# EAGLE design hw2 (EAGLE 7.5.0)
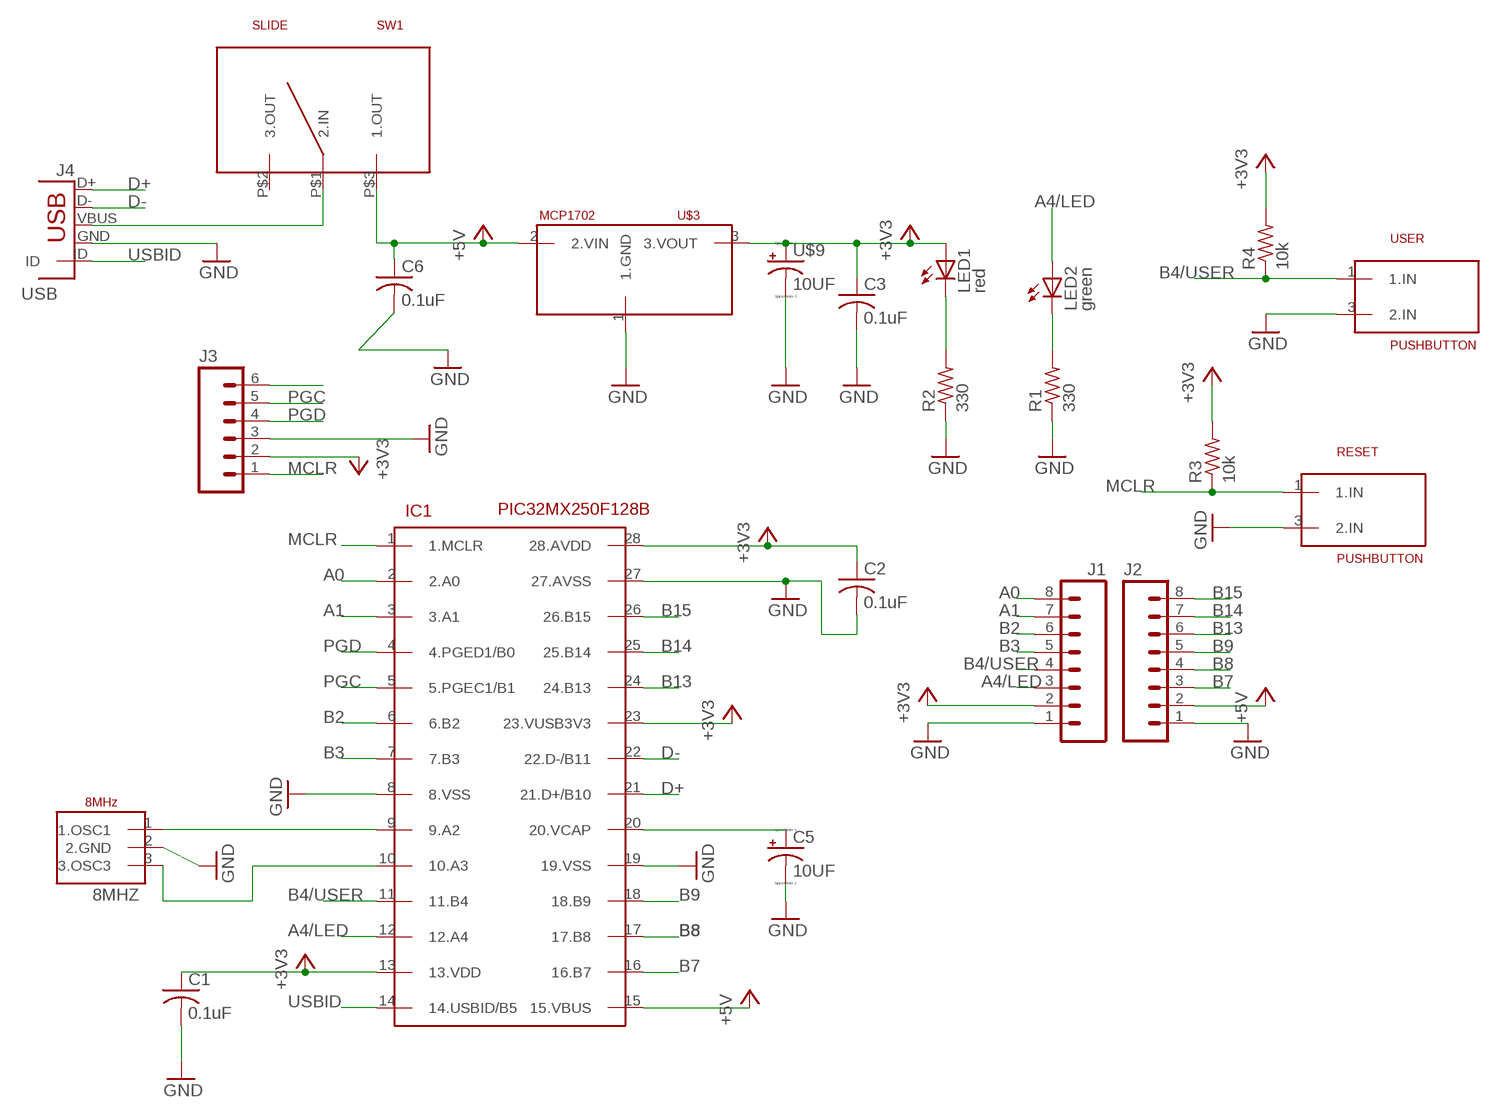
[diagram p0: schematic, sheet 1]

## Parts
C1  0.1uF  C-US025-025X050  [C025-025X050]
C2  0.1uF  C-US025-025X050  [C025-025X050]
C3  0.1uF  C-US025-025X050  [C025-025X050]
C5  10UF  [TT2D4]
C6  0.1uF  C-US025-025X050  [C025-025X050]
J1  M08  [1X08_ROUND]
J2  M08  [1X08_ROUND]
J3  M06SILK_FEMALE_PTH  [1X06]
J4  USB  [USB-MB-H]
LED1  red  LED3MM  [LED3MM]
LED2  green  LED3MM  [LED3MM]
PIC  PIC32MX250F128B  PIC  [DIL28-3]
R1  330  R-US_0207/10  [0207/10]
R2  330  R-US_0207/10  [0207/10]
R3  10k  R-US_0207/10  [0207/10]
R4  10k  R-US_0207/10  [0207/10]
RESET  PUSHBUTTON  [1X03]
SLIDE  SW1  SLIDE  [SLIDEWITCH]
U$2  8MHZ  [1X03]
U$3  MCP1702  [TO92]
U$9  10UF  [TT2D4]
USER  PUSHBUTTON  [1X03]

## Nets
+3V3: C1.1 C2.1 C3.1 J1.2 J3.2 LED1.A PIC.13(13.VDD) PIC.23(23.VUSB3V3) PIC.28(28.AVDD) R3.2 R4.2 U$3.3(3.VOUT) U$9.+
+5V: C6.1 J2.2 PIC.15(15.VBUS) SLIDE.P$3(1.OUT) U$3.2(2.VIN)
A0: J1.8 PIC.2(2.A0)
A1: J1.7 PIC.3(3.A1)
A4/LED: J1.3 LED2.A PIC.12(12.A4)
B2: J1.6 PIC.6(6.B2)
B3: J1.5 PIC.7(7.B3)
B4/USER: J1.4 PIC.11(11.B4) R4.1 USER.1(1.IN)
B7: J2.3 PIC.16(16.B7)
B8: J2.4 PIC.17(17.B8)
B9: J2.5 PIC.18(18.B9)
B13: J2.6 PIC.24(24.B13)
B14: J2.7 PIC.25(25.B14)
B15: J2.8 PIC.26(26.B15)
D+: J4.D+ PIC.21(21.D+/B10)
D-: J4.D- PIC.22(22.D-/B11)
GND: C1.2 C2.2 C3.2 C5.- C6.2 J1.1 J2.1 J3.3 J4.GND PIC.8(8.VSS) PIC.19(19.VSS) PIC.27(27.AVSS) R1.1 R2.1 RESET.3(2.IN) U$2.2(2.GND) U$3.1(1.GND) U$9.- USER.3(2.IN)
MCLR: J3.1 PIC.1(1.MCLR) R3.1 RESET.1(1.IN)
N$1: LED2.K(C) R1.2
N$2: J4.VBUS SLIDE.P$1(2.IN)
N$3: LED1.K(C) R2.2
N$4: J3.6
N$9: PIC.9(9.A2) U$2.1(1.OSC1)
N$10: PIC.10(10.A3) U$2.3(3.OSC3)
N$20: C5.+ PIC.20(20.VCAP)
PGC: J3.5 PIC.5(5.PGEC1/B1)
PGD: J3.4 PIC.4(4.PGED1/B0)
USBID: J4.ID PIC.14(14.USBID/B5)
Unconnected: SLIDE.P$2(3.OUT)

## Library data of the parts
C1-C3 C6 = me433:C-US: CAPACITOR, American symbol
C5 U$9 = me433:10UF
J1 J2 = me433:M08: Header 8 Standard 8-pin 0.1" header. Use with straight break away headers (SKU : PRT-00116), right angle break away headers (PRT-00553), swiss pins (PRT-00743), machine pins (PRT-00117), and female headers (PRT-00115).; PROD_ID: CONN-08437
J3 = me433:M06: Header 6 Standard 6-pin 0.1" header. Use with straight break away headers (SKU : PRT-00116), right angle break away headers (PRT-00553), swiss pins (PRT-00743), machine pins (PRT-00117), and female headers (PRT-00115). Molex polarized connector foot print use with SKU : PRT-08094 with associated crimp pins and housings. NOTES ON THE VARIANTS LOCK and LOCK_LONGPADS... This footprint was designed to help hold the alignment of a through-hole component (i.e. 6-pin header) while soldering it into place. You may notice that each hole has been shifted either up or down by 0.005 of an inch from it's more standard position (which is a perfectly straight line). This slight alteration caused the pins (the squares in the middle) to touch the edges of the holes. Because they are alternating, it causes a "brace" to hold the component in place. 0.005 has proven to be the perfect amount of "off-center" position when using our standard breakaway headers. Although looks a little odd when you look at the bare footprint, once you have a header in there, the alteration is very hard to notice. Also,if you push a header all the way into place, it is covered up entirely on the bottom side. This idea of altering the position of holes to aid alignment will be further integrated into the Sparkfun Library for other footprints. It can help hold any component with 3 or more connection pins.; PROD_ID: CONN-08437
J4 = me433:USB
LED1 LED2 = me433:LED: LED OSRAM: - CHIPLED LG R971, LG N971, LY N971, LG Q971, LY Q971, LO R971, LY R971 LH N974, LH R974 LS Q976, LO Q976, LY Q976 LO Q996 - Hyper CHIPLED LW Q18S LB Q993, LB Q99A, LB R99A - SideLED LS A670, LO A670, LY A670, LG A670, LP A670 LB A673, LV A673, LT A673, LW A673 LH A674 LY A675 LS A676, LA A676, LO A676, LY A676, LW A676 LS A679, LY A679, LG A679 - Hyper Micro SIDELED® LS Y876, LA Y876, LO Y876, LY Y876 LT Y87S - SmartLED LW L88C, LW L88S LB L89C, LB L89S, LG L890 LS L89K, LO L89K, LY L89K LS L896, LA L896, LO L896, LY L896 - TOPLED LS T670, LO T670, LY T670, LG T670, LP T670 LSG T670, LSP T670, LSY T670, LOP T670, LYG T670 LG T671, LOG T671, LSG T671 LB T673, LV T673, LT T673, LW T673 LH T674 LS T676, LA T676, LO T676, LY T676, LB T676, LH T676, LSB T676, LW T676 LB T67C, LV T67C, LT T67C, LS T67K, LO T67K, LY T67K, LW E67C LS E67B, LA E67B, LO E67B, LY E67B, LB E67C, LV E67C, LT E67C LW T67C LS T679, LY T679, LG T679 LS T770, LO T770, LY T770, LG T770, LP T770 LB T773, LV T773, LT T773, LW T773 LH T774 LS E675, LA E675, LY E675, LS T675 LS T776, LA T776, LO T776, LY T776, LB T776 LHGB T686 LT T68C, LB T68C - Hyper Mini TOPLED® LB M676 - Mini TOPLED Santana® LG M470 LS M47K, LO M47K, LY M47K Source: http://www.osram.convergy.de LUXEON: - LUMILED® LXK2-PW12-R00, LXK2-PW12-S00, LXK2-PW14-U00, LXK2-PW14-V00 LXK2-PM12-R00, LXK2-PM12-S00, LXK2-PM14-U00 LXK2-PE12-Q00, LXK2-PE12-R00, LXK2-PE12-S00, LXK2-PE14-T00, LXK2-PE14-U00 LXK2-PB12-K00, LXK2-PB12-L00, LXK2-PB12-M00, LXK2-PB14-N00, LXK2-PB14-P00, LXK2-PB14-Q00 LXK2-PR12-L00, LXK2-PR12-M00, LXK2-PR14-Q00, LXK2-PR14-R00 LXK2-PD12-Q00, LXK2-PD12-R00, LXK2-PD12-S00 LXK2-PH12-R00, LXK2-PH12-S00 LXK2-PL12-P00, LXK2-PL12-Q00, LXK2-PL12-R00 Source: www.luxeon.com KINGBRIGHT: KA-3528ASYC Source: www.kingbright.com
PIC = me433:PIC
R1-R4 = me433:R-US_: RESISTOR, American symbol
RESET USER = me433:PUSHBUTTON
SLIDE = me433:SLIDE
U$2 = me433:8MHZ
U$3 = me433:MCP1702

## Board
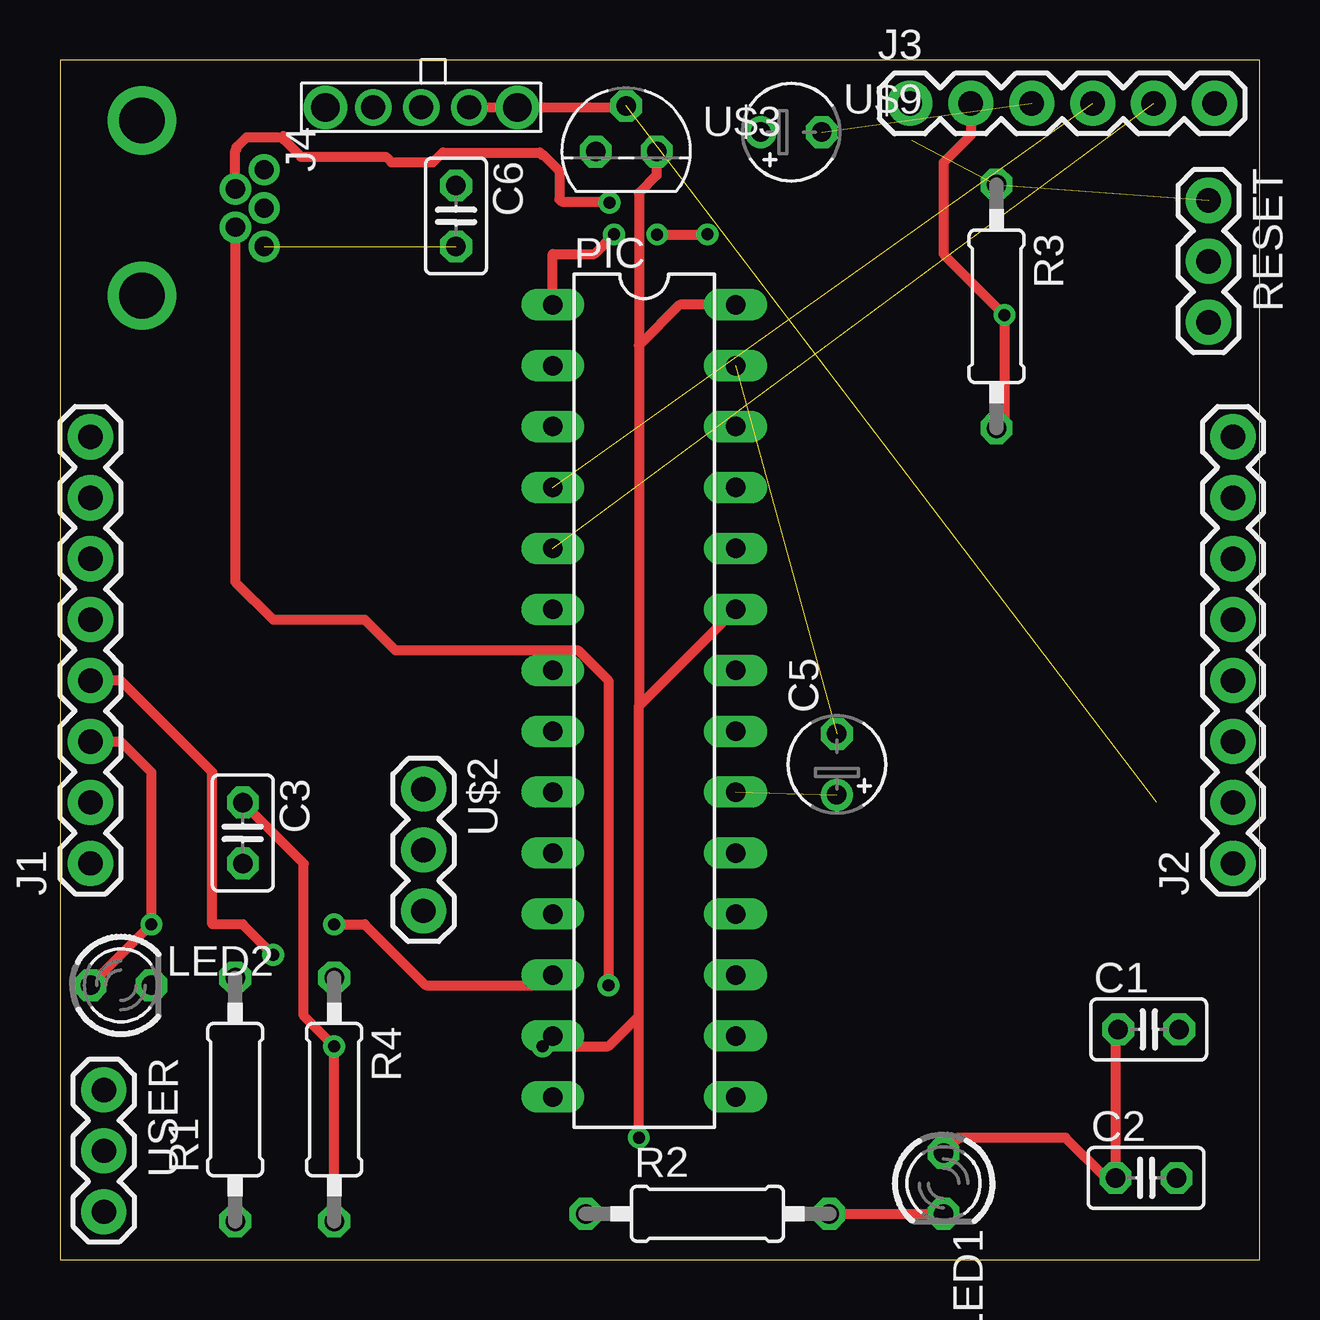
[diagram p1: board, top side]
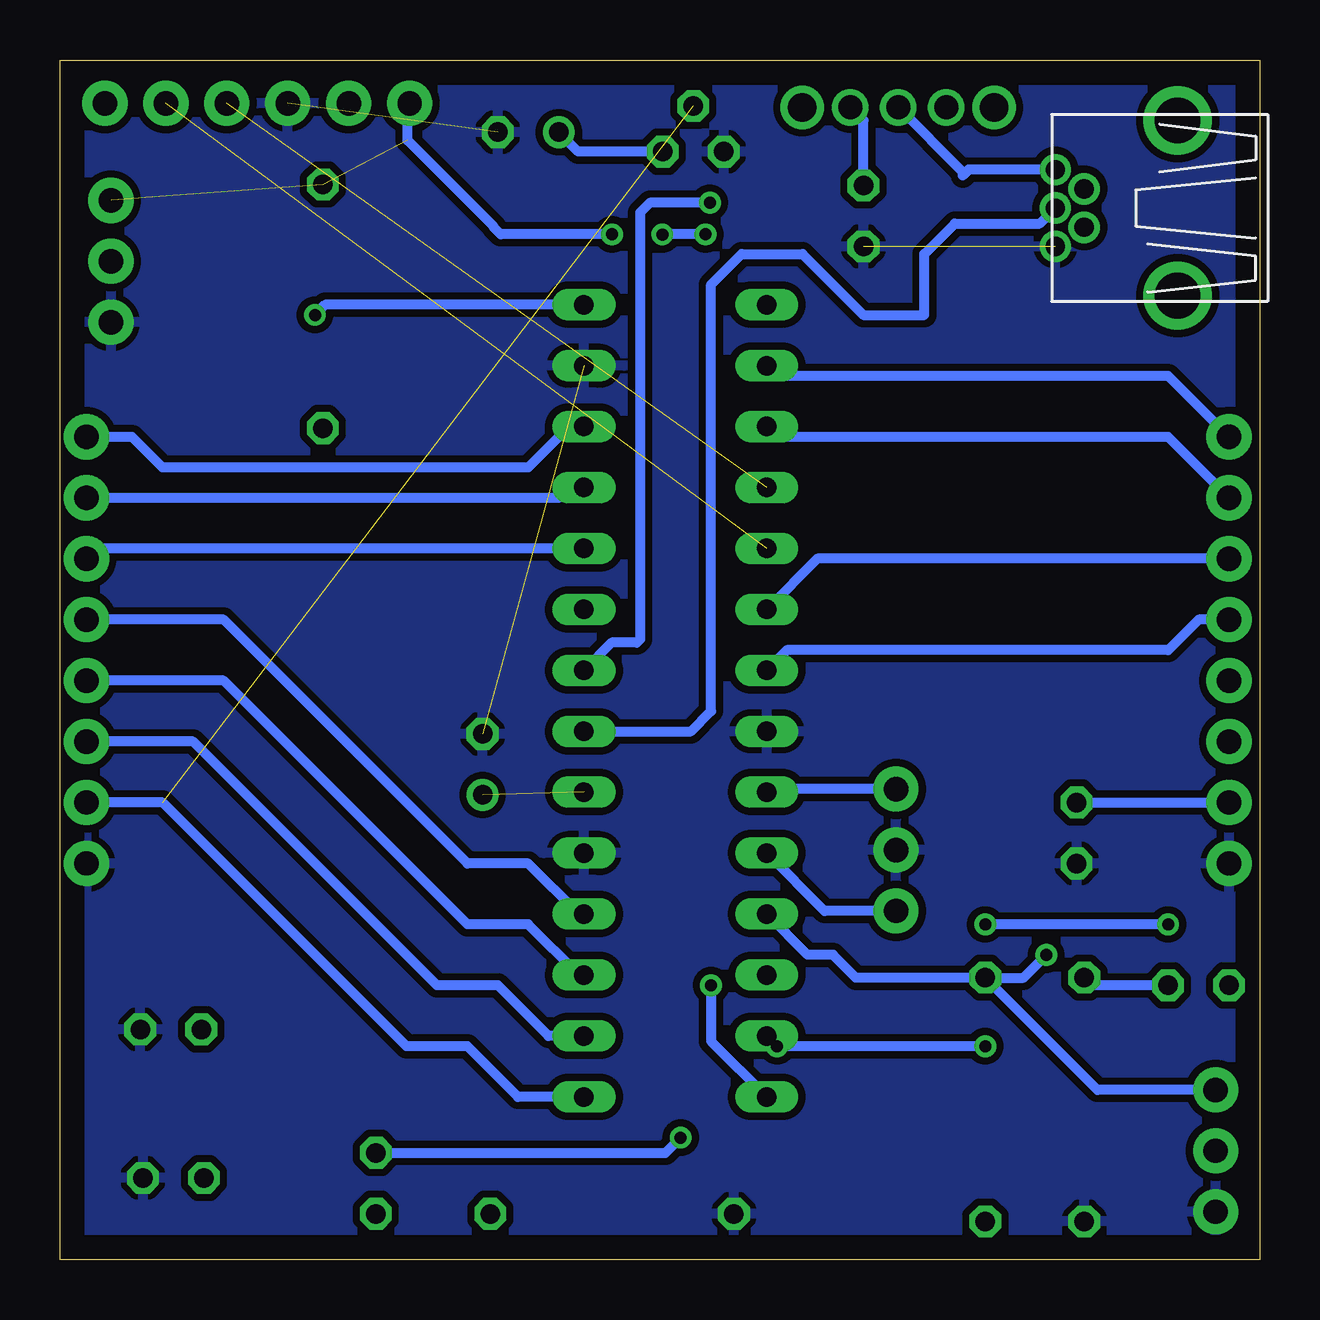
[diagram p2: board, bottom side, seen from below]

Size 50 x 50 mm. Coordinates in mm from the lower left corner, seen from the top.
Outline: 0,0 50,0 50,50 0,50 0,0
Copper layers (1*16): Top 0.035mm / dielectric 1.5mm / Bottom 0.035mm
Design rules "default": minimum track width 10mil, minimum drill 24mil, track to track 8mil, track to pad 8mil, pad to pad 8mil, via to via 8mil, smd to smd 8mil, copper to edge 40mil, drill to drill 8mil, minimum pad ring 10mil, minimum via ring 8mil, stop-mask expansion 4mil, vias tented up to drill 0mil, thermal gap 10mil

### Footprints (pad centres in the part's own frame; a part is rotated, then mirrored left to right if it is on the bottom)
C025-025X050 = drill 0.813 octagon: 1 -1.27,0; 2 1.27,0
TT2D4 = drill 0.813: + -1.27,0 | drill 0.813 octagon: - 1.27,0
1X08_ROUND = drill 1.016 pad 1.88: 1 0,0; 2 2.54,0; 3 5.08,0; 4 7.62,0; 5 10.16,0; 6 12.7,0; 7 15.24,0; 8 17.78,0
1X06 = drill 1.016 pad 1.88: 1 0,0; 2 2.54,0; 3 5.08,0; 4 7.62,0; 5 10.16,0; 6 12.7,0
USB-MB-H = drill 0.8: D+ 5.1,0; D- 3.9,0.8; GND 5.1,-1.6; ID 3.9,-0.8; VBUS 5.1,1.6 | drill 1.9: P$6 0,-3.65; P$7 0,3.65
LED3MM = drill 0.813 octagon: A -1.27,0; K 1.27,0
DIL28-3 = drill 0.813 long: 1 -16.51,-3.81; 2 -13.97,-3.81; 3 -11.43,-3.81; 4 -8.89,-3.81; 5 -6.35,-3.81; 6 -3.81,-3.81; 7 -1.27,-3.81; 8 1.27,-3.81; 9 3.81,-3.81; 10 6.35,-3.81; 11 8.89,-3.81; 12 11.43,-3.81; 13 13.97,-3.81; 14 16.51,-3.81; 15 16.51,3.81; 16 13.97,3.81; 17 11.43,3.81; 18 8.89,3.81; 19 6.35,3.81; 20 3.81,3.81; 21 1.27,3.81; 22 -1.27,3.81; 23 -3.81,3.81; 24 -6.35,3.81; 25 -8.89,3.81; 26 -11.43,3.81; 27 -13.97,3.81; 28 -16.51,3.81
0207/10 = drill 0.813 octagon: 1 -5.08,0; 2 5.08,0
1X03 = drill 1.016 pad 1.88: 1 0,0; 2 2.54,0; 3 5.08,0
SLIDEWITCH = drill 1: P$1 0,0; P$2 -2,0; P$3 2,0 | drill 1.2: P$4 4,0; P$5 -4,0
TO92 = drill 0.813 octagon: 1 -1.27,0; 2 0,1.905; 3 1.27,0

### Placement (x,y rotation side)
C1  45.38,9.59 0 top
C2  45.27,3.4 0 top
C3  7.62,17.78 270 top
C5  32.38,20.64 90 top
C6  16.51,43.5 270 top
J1  1.27,16.51 90 top
J2  48.9,16.51 90 top
J3  35.42,48.2 0 top
J4  3.41,43.83 0 top
LED1  36.83,3.17 270 top
LED2  2.54,11.43 0 top
PIC  24.35,23.29 270 top
R1  7.3,6.67 90 top
R2  26.99,1.91 0 top
R3  39.04,39.73 270 top
R4  11.43,6.67 270 top
RESET  47.88,44.15 270 top
SLIDE  15.06,48.02 0 top
U$2  15.15,19.61 270 top
U$3  23.6,46.18 0 top
U$9  30.48,46.99 0 top
USER  1.83,7.07 270 top

### Tracks (layer width: path | path; a pad name or v marks a point on that pad's centre or on a via)
+3V3  (via drill 0.5)
  Top 0.406: R4.2 v11.43,8.89 10.16,10.16 10.16,16.51 C3.1 | C1.1 44,9.48 C2.1 43.59,3.4 41.91,5.08 37.47,5.08 LED1.A | v24.13,5.08 24.13,10.16 | 24.13,10.16 24.13,23.07 | 24.13,23.07 PIC.23 | v20.11,8.89 22.86,8.89 24.13,10.16 | PIC.28 25.83,39.8 24.13,38.1 | 24.13,38.1 24.13,23.07 | U$3.3 24.87,45.19 24.13,44.45 24.13,38.1 | R3.2 39.37,34.98 v39.37,39.37 36.83,41.91 36.83,45.72 37.97,46.85 J3.2
  Bottom 0.406: v11.43,8.89 v20.11,8.89 PIC.13 | C3.1 J1.2 | LED1.A 24.77,4.45 v24.13,5.08 | PIC.28 38.94,39.8 v39.37,39.37 | U$3.3 28.4,46.18 U$9.+
+5V  (1 unrouted)
  Top 0.406: SLIDE.P$3 23.54,48.02 U$3.2
  Bottom 0.406: PIC.15 30.91,6.78 33.02,8.89 35.56,8.89 45.72,19.05 J2.2 | C6.1 16.51,47.47 SLIDE.P$3
A0
  Bottom 0.406: J1.8 3.81,36.83 20.11,36.83 PIC.2
A1
  Bottom 0.406: J1.7 3.81,34.29 20.11,34.29 PIC.3
A4/LED  (via drill 0.5)
  Top 0.406: J1.3 2.54,21.59 3.81,20.32 v3.81,13.97 LED2.A | v11.43,13.97 12.7,13.97 15.24,11.43 20.11,11.43 PIC.12
  Bottom 0.406: v3.81,13.97 v11.43,13.97
B2
  Bottom 0.406: J1.6 18.43,29.21 PIC.6
B3
  Bottom 0.406: J1.5 2.54,26.67 3.81,25.4 19.7,25.4 PIC.7
B4/USER  (via drill 0.5)
  Top 0.406: v8.89,12.7 7.62,13.97 6.35,13.97 6.35,20.32 2.54,24.13 J1.4
  Bottom 0.406: USER.1 6.75,7.07 R4.1 | R4.1 16.83,11.75 17.78,12.7 18.84,12.7 PIC.11 | R4.1 9.84,11.75 v8.89,12.7
B7
  Bottom 0.406: PIC.16 29.64,9.32 31.75,11.43 34.29,11.43 44.45,21.59 J2.3
B8
  Bottom 0.406: PIC.17 28.37,11.86 30.48,13.97 33.02,13.97 43.18,24.13 J2.4
B9
  Bottom 0.406: PIC.18 28.37,14.4 30.48,16.51 33.02,16.51 43.18,26.67 J2.5
B13
  Bottom 0.406: PIC.24 48.47,29.64 J2.6
B14
  Bottom 0.406: PIC.25 28.78,32.18 29.21,31.75 J2.7
B15
  Bottom 0.406: PIC.26 28.78,34.72 30.48,33.02 45.72,33.02 46.99,34.29 J2.8
D+
  Bottom 0.406: PIC.21 23.7,22.02 22.86,22.86 22.86,40.64 21.59,41.91 19.05,41.91 16.51,39.37 13.97,39.37 13.97,41.91 12.7,43.18 9.16,43.18 J4.D+
D-  (via drill 0.5)
  Top 0.406: J4.D- 7.31,46.23 7.36,46.28 7.36,46.37 7.77,46.78 9.27,46.78 9.32,46.83 9.32,46.69 10.05,45.96 13.59,45.96 13.82,45.73 15.55,45.73 15.96,46.14 20,46.14 20.09,46.05 20.14,46.05 20.82,45.37 20.82,44.19 20.91,44.09 22.86,44.09 v22.91,44.05
  Bottom 0.406: v22.91,44.05 25.41,44.05 25.82,43.64 25.82,25.85 25.96,25.71 27.01,25.71 PIC.22
GND  (3 unrouted)
  pour Bottom (isolate 0.305): 0,49.53 0,0 49.53,0 49.53,49.53
MCLR  (via drill 0.5)  (2 unrouted)
  Top 0.406: PIC.1 20.54,41.9 20.55,41.91 22.27,41.91 v23.09,42.73 | v24.89,42.73 v26.98,42.73 v26.99,42.73
  Bottom 0.406: v23.09,42.73 v24.89,42.73 | v26.99,42.73 31.63,42.73 31.91,43.02 31.91,43.05 35.51,46.65 35.51,48.11 J3.1
N$1
  Bottom 0.406: LED2.K 6.99,11.43 R1.2
N$2
  Bottom 0.406: J4.VBUS 12.12,45.43 12.37,45.19 12.37,45.33 SLIDE.P$1
N$3
  Top 0.406: R2.2 LED1.K
N$9
  Bottom 0.406: U$2.1 20.41,19.61 PIC.9
N$10
  Bottom 0.406: U$2.3 18.13,14.53 PIC.10
N$20  (1 unrouted)
PGC  (1 unrouted)
PGD  (1 unrouted)
USBID  (via drill 0.5)
  Top 0.406: J4.ID 7.31,28.25 8.89,26.67 12.7,26.67 13.97,25.4 21.59,25.4 22.86,24.13 v22.86,11.43
  Bottom 0.406: v22.86,11.43 22.86,9.1 PIC.14